# EAGLE design og1.1 (EAGLE 7.6.0)
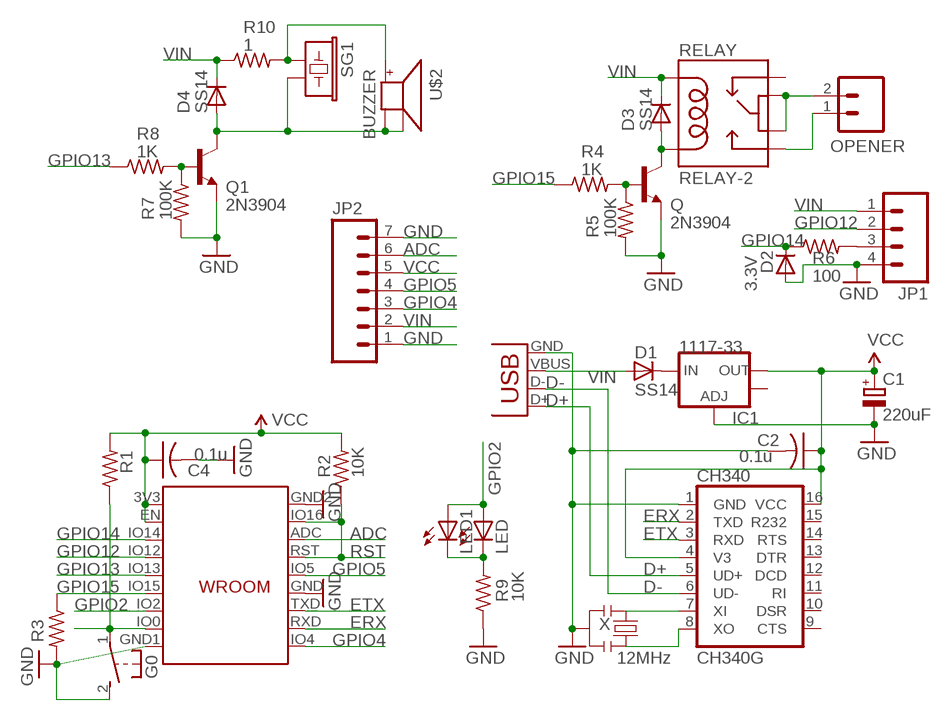
[diagram p0: schematic, sheet 1]

## Parts
C1  220uF  CPOL-EUCT3528  [CT3528]
C2  0.1u  C-USC0603K  [C0603K]
C4  0.1u  C-USC0603K  [C0603K]
CH340  CH340G  [SO16]
D1  SS14  DIODE-DO-214AC  [DO-214AC]
D2  3.3V  DIODE-MINIMELF  [MINIMELF]
D3  SS14  DIODE-DO-214AC  [DO-214AC]
D4  SS14  DIODE-DO-214AC  [DO-214AC]
ESP  WROOM02  [WROOM]
G0  31-XX  [B3F-31XX]
IC1  1117-33  V_REG_LM1117SOT223  [SOT223]
JP1  M04SONIC  [1X04_SONICSENSOR]
JP2  M07  [1X07]
LED  LEDLED3MM_ABBRV  [LED3MM_ABBRV]
LED1  LEDCHIPLED_0805  [CHIPLED_0805]
OPENER  OPENER  M024MM-X  [SCREWTERMINAL-4MM-2-X]
Q  2N3904  TRANSISTOR_NPNSOT23-3  [SOT23-3]
Q1  2N3904  TRANSISTOR_NPNSOT23-3  [SOT23-3]
R1  10K  R-US_R0603  [R0603]
R2  10K  R-US_R0603  [R0603]
R3  10K  R-US_R0603  [R0603]
R4  1K  R-US_R0603  [R0603]
R5  100K  R-US_R0603  [R0603]
R6  100  R-US_R0603  [R0603]
R7  100K  R-US_R0603  [R0603]
R8  1K  R-US_R0603  [R0603]
R9  10K  R-US_R0603  [R0603]
R10  1  R-US_R0603  [R0603]
RELAY  RELAY-2  [RELAY-HK4100F]
SG1  BUZZERPTH  [BUZZER-12MM]
U$2  BUZZER  [SMT-8585-BUZZER]
X  12MHz  RESONATORSMD  [RESONATOR-SMD]
X3  USB-MICROB  [USB-MICROB]

## Nets
ADC: ESP.ADC JP2.6
D+: CH340.5(UD+) X3.D+
D-: CH340.6(UD-) X3.D-
ERX: CH340.2(TXD) ESP.RXD(RX)
ETX: CH340.3(RXD) ESP.TXD(TX)
GND: C1.- C2.2 C4.2 CH340.1(GND) D2.A ESP.GND ESP.GND1 ESP.GND2 G0.2(S) IC1.1(ADJ) JP1.4 JP2.1 JP2.7 Q1.2(E) Q.2(E) R3.2 R5.2 R7.2 R9.1 X3.GND X.2
GPIO0: ESP.IO0 G0.1(P) R1.1
GPIO2: ESP.IO2 LED1.A LED.A
GPIO4: ESP.IO4 JP2.3
GPIO5: ESP.IO5 JP2.4
GPIO12: ESP.IO12 JP1.2
GPIO13: ESP.IO13 R8.1
GPIO14: D2.C ESP.IO14 R6.1
GPIO15: ESP.IO15 R3.1 R4.1
N$1: D1.C IC1.3(IN)
N$2: Q.1(B) R4.2 R5.1
N$3 [relaypower]: OPENER.2 RELAY.5 RELAY.6
N$4 [relaypower]: OPENER.1 RELAY.10
N$5: JP1.3 R6.2
N$6 [power]: D4.A Q1.3(C) SG1.- U$2.- U$2.A-
N$7: LED1.C LED.K(C) R9.2
N$8: Q1.1(B) R7.1 R8.2
N$9 [power]: R10.2 SG1.+ U$2.+
N$11: CH340.7(XI) X.1
N$13: CH340.8(XO) X.3
N$32 [power]: D3.A Q.3(C) RELAY.9
RST: ESP.IO16 ESP.RST R2.1
VCC [power]: C1.+ C2.1 C4.1 CH340.4(V3) CH340.16(VCC) ESP.3V3(VCC) ESP.EN IC1.2(OUT) JP2.5 R1.2 R2.2
VIN [power]: D1.A D3.C D4.C JP1.1 JP2.2 R10.1 RELAY.2 X3.VBUS
Unconnected: CH340.9(CTS) CH340.10(DSR) CH340.11(RI) CH340.12(DCD) CH340.13(DTR) CH340.14(RTS) CH340.15(R232) IC1.4(OUT) RELAY.1

## Library data of the parts
C1 = rcl:CPOL-EU: POLARIZED CAPACITOR, European symbol
C2 C4 = adafruit:C-US: CAPACITOR, American symbol
CH340 = SparkFunNew:CH340
D1-D4 = diode:DIODE-: DIODE
ESP = JeeParts:WROOM
G0 = adafruit:31-XX: OMRON SWITCH Now with beefier pads!
IC1 = SparkFun:V_REG_LM1117: Voltage Regulator LM1117 Standard adjustable voltage regulator but in SMD form. Spark Fun Electronics SKU : COM-00595
JP1 = SparkFun:M04: Header 4 Standard 4-pin 0.1" header. Use with straight break away headers (SKU : PRT-00116), right angle break away headers (PRT-00553), swiss pins (PRT-00743), machine pins (PRT-00117), and female headers (PRT-00115). Molex polarized connector foot print use with SKU : PRT-08231 with associated crimp pins and housings.
JP2 = SparkFun:M07: Header 7 Standard 7-pin 0.1" header. Use with straight break away headers (SKU : PRT-00116), right angle break away headers (PRT-00553), swiss pins (PRT-00743), machine pins (PRT-00117), and female headers (PRT-00115). NOTES ON THE VARIANTS LOCK and LOCK_LONGPADS... This footprint was designed to help hold the alignment of a through-hole component (i.e. 7-pin header) while soldering it into place. You may notice that each hole has been shifted either up or down by 0.005 of an inch from it's more standard position (which is usually a perfectly straight line). This slight alteration caused the pins (the squares in the middle) to touch the edges of the holes. Because they are alternating, it causes a "brace" to hold the header in place. 0.005 has proven to be the perfect amount of "off-center" position when using our standard breakaway headers. Although looks a little odd when you look at the bare footprint, once you have a header in there, the alteration is very hard to notice. Also, if you push a header all the way into place, it is covered up entirely on the bottom side. This idea of altering the position of holes to aid alignment will be further integrated into the Sparkfun Library for other footprints. It can help hold any component with 3 or more connection pins.
LED LED1 = adafruit:LED: LED OSRAM: - CHIPLED LG R971, LG N971, LY N971, LG Q971, LY Q971, LO R971, LY R971 LH N974, LH R974 LS Q976, LO Q976, LY Q976 LO Q996 - Hyper CHIPLED LW Q18S LB Q993, LB Q99A, LB R99A - SideLED LS A670, LO A670, LY A670, LG A670, LP A670 LB A673, LV A673, LT A673, LW A673 LH A674 LY A675 LS A676, LA A676, LO A676, LY A676, LW A676 LS A679, LY A679, LG A679 - Hyper Micro SIDELED® LS Y876, LA Y876, LO Y876, LY Y876 LT Y87S - SmartLED LW L88C, LW L88S LB L89C, LB L89S, LG L890 LS L89K, LO L89K, LY L89K LS L896, LA L896, LO L896, LY L896 - TOPLED LS T670, LO T670, LY T670, LG T670, LP T670 LSG T670, LSP T670, LSY T670, LOP T670, LYG T670 LG T671, LOG T671, LSG T671 LB T673, LV T673, LT T673, LW T673 LH T674 LS T676, LA T676, LO T676, LY T676, LB T676, LH T676, LSB T676, LW T676 LB T67C, LV T67C, LT T67C, LS T67K, LO T67K, LY T67K, LW E67C LS E67B, LA E67B, LO E67B, LY E67B, LB E67C, LV E67C, LT E67C LW T67C LS T679, LY T679, LG T679 LS T770, LO T770, LY T770, LG T770, LP T770 LB T773, LV T773, LT T773, LW T773 LH T774 LS E675, LA E675, LY E675, LS T675 LS T776, LA T776, LO T776, LY T776, LB T776 LHGB T686 LT T68C, LB T68C - Hyper Mini TOPLED® LB M676 - Mini TOPLED Santana® LG M470 LS M47K, LO M47K, LY M47K Source: http://www.osram.convergy.de/
OPENER = SparkFun:M02: Header 2 Standard 2-pin 0.1" header. Use with straight break away headers (SKU : PRT-00116), right angle break away headers (PRT-00553), swiss pins (PRT-00743), machine pins (PRT-00117), and female headers (PRT-00115). Molex polarized connector foot print use with SKU : PRT-08233 with associated crimp pins and housings.
Q Q1 = SparkFunNew:TRANSISTOR_NPN: Transistor NPN BJT configuration in SOT23 package. MMBT2222 is the common NPN we use. Double check BCE configuration again layout.
R1-R3 R9 = adafruit (picker 的冲突副本 2014-10-29):R-US_: RESISTOR, American symbol
R4-R8 R10 = adafruit2013:R-US_: RESISTOR, American symbol
RELAY = SparkFunNew:RELAY-2
SG1 = SparkFunNew:BUZZER: Buzzer 12mm Spark Fun Electronics SKU : Comp-Buzzer
U$2 = adafruit:BUZZER
X = SparkFunNew:RESONATOR: Resonator Small SMD resonator. This is the itty bitty 10/20MHz resonators with built in caps. CSTCE10M0G55 and CSTCE20M0V53. Footprint has been reviewed closely but hasn't been tested yet.
X3 = SparkFunNew:USB: USB Connectors USB-B-PTH is fully proven SKU : PRT-00139 USB-miniB is fully proven SKU : PRT-00587 USB-A-PCB is untested. USB-A-H is throughly reviewed, but untested. Spark Fun Electronics SKU : PRT-00437 USB-B-SMT is throughly reviewed, but untested. Needs silkscreen touching up. USB-A-S has not been used/tested USB-MB-H has not been used/tested

## Net classes
0 default: width 0.178 mm, clearance 0.178 mm
1 power: width 0.305 mm, clearance 0.203 mm
2 relaypower: width 0.508 mm, clearance 0.305 mm

## Board
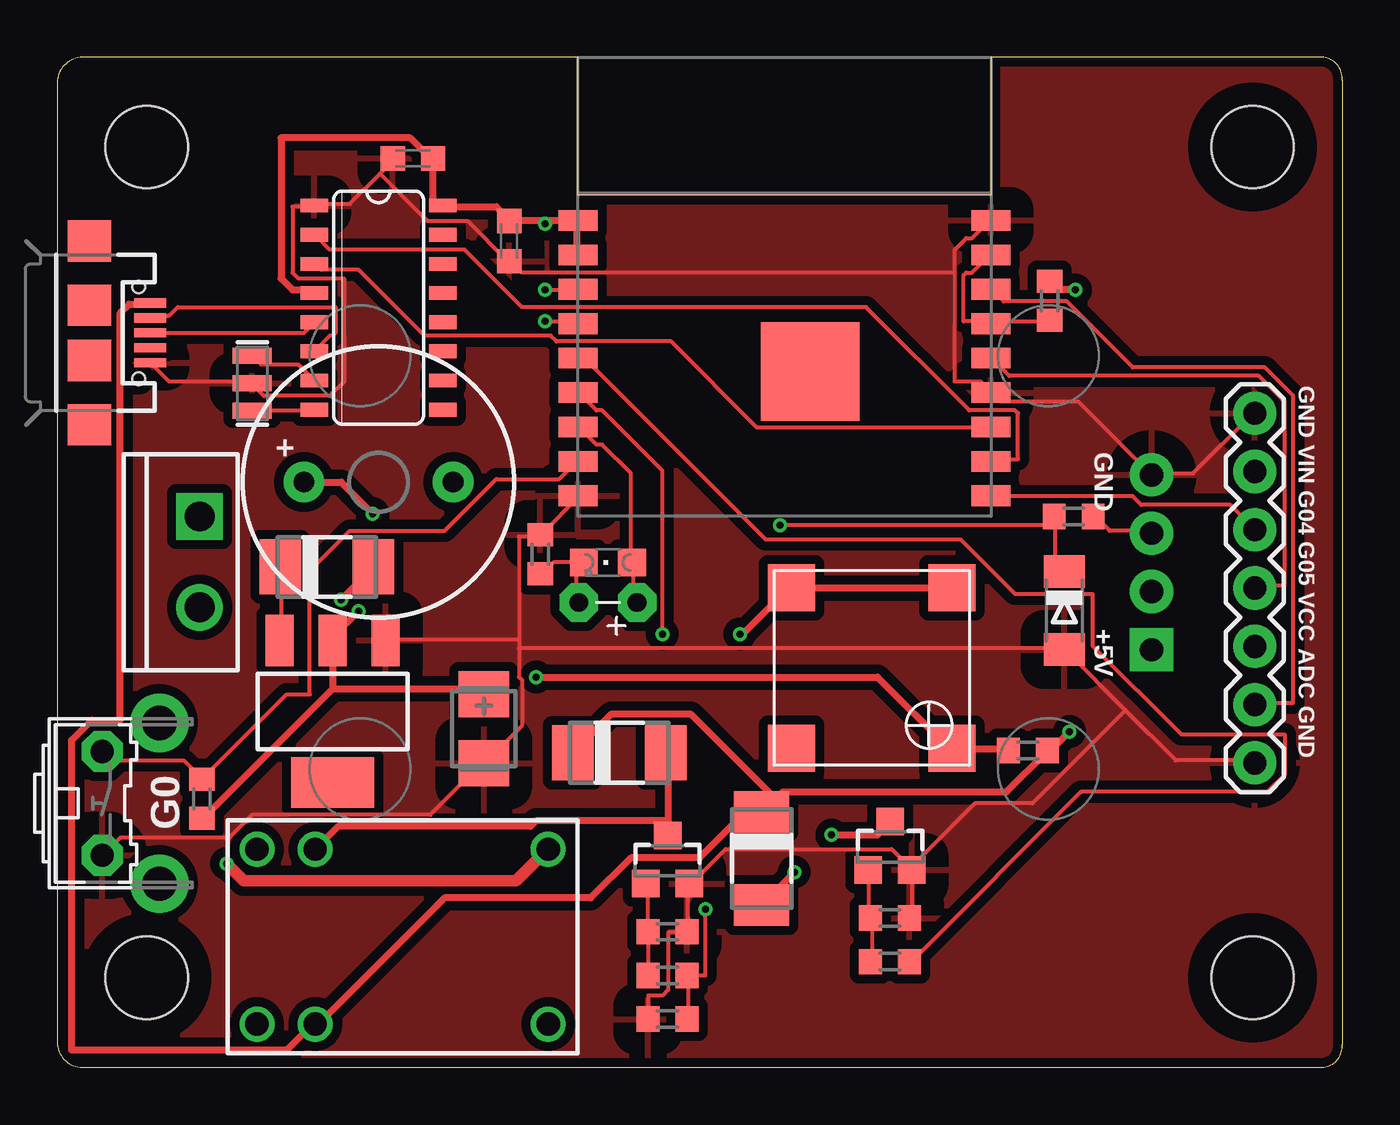
[diagram p1: board, top side]
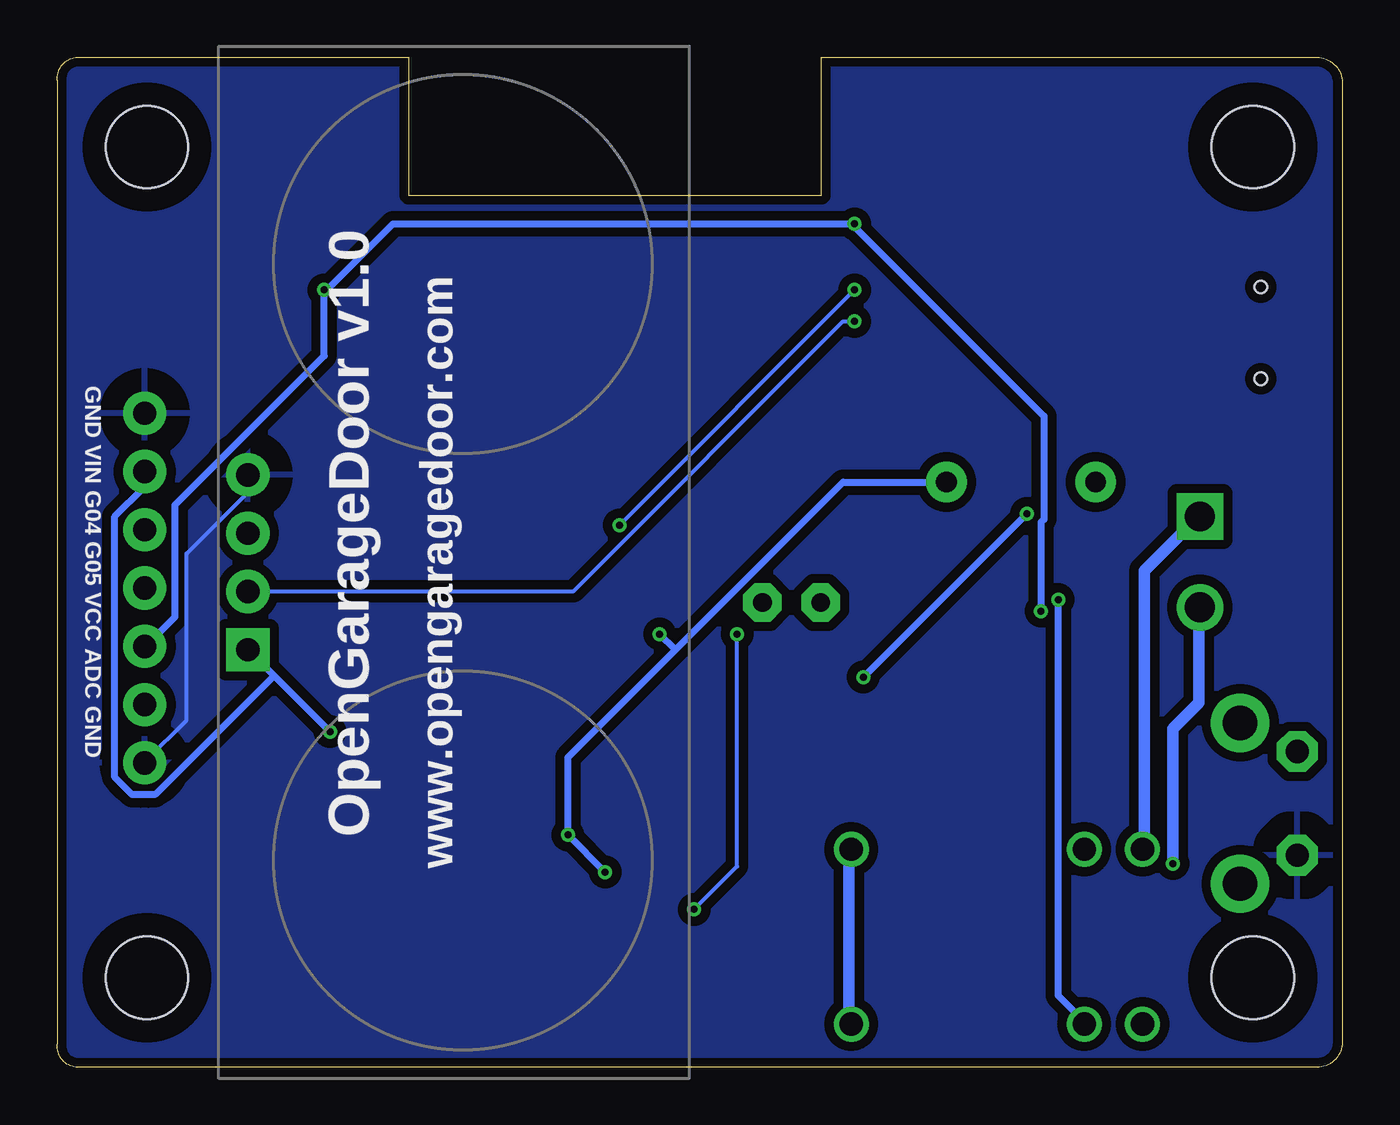
[diagram p2: board, bottom side, seen from below]

Size 56.01 x 44.01 mm. Coordinates in mm from the lower left corner, seen from the top.
Outline: 0,43 0,1 arc90 1.2,0 55.2,0 arc90 56,1 56,43 arc90 55.2,44 40.7,44 40.7,38 22.7,38 22.7,44 1.2,44 arc90 0,43
Copper layers (1*16): Top 0.035mm / dielectric 1.5mm / Bottom 0.035mm
Design rules "Fusion_eagle_rule_v1.1 *": minimum track width 6mil, minimum drill 12mil, track to track 6mil, track to pad 6mil, pad to pad 6mil, via to via 6mil, smd to smd 0mil, copper to edge 10mil, drill to drill 10mil, minimum pad ring 10mil, minimum via ring 6mil, stop-mask expansion 2mil, vias tented up to drill 100mil, thermal gap 40mil
Holes 3.6 mm at 3.9,3.9 52.1,3.9 3.9,40.1 52.1,40.1
tRestrict: area 1.5,37.7 to 6.3,42.5; area 1.5,1.5 to 6.3,6.3; area 49.7,37.7 to 54.5,42.5; area 49.7,1.5 to 54.5,6.3
bRestrict: area 1.5,37.7 to 6.3,42.5; area 1.5,1.5 to 6.3,6.3; area 49.7,1.5 to 54.5,6.3; area 49.7,37.7 to 54.5,42.5
vRestrict: area 22.8,24 to 40.6,38

### Footprints (pad centres in the part's own frame; a part is rotated, then mirrored left to right if it is on the bottom)
CT3528 = smd 2 x 2.2: + -1.5,0; - 1.5,0
C0603K = smd 1.05 x 1.08: 1 -0.875,0; 2 0.875,0
SO16 = smd 0.6 x 1.2: 1 -4.445,-2.8; 2 -3.175,-2.8; 3 -1.905,-2.8; 4 -0.635,-2.8; 5 0.635,-2.8; 6 1.905,-2.8; 7 3.175,-2.8; 8 4.445,-2.8; 9 4.445,2.8; 10 3.175,2.8; 11 1.905,2.8; 12 0.635,2.8; 13 -0.635,2.8; 14 -1.905,2.8; 15 -3.175,2.8; 16 -4.445,2.8
DO-214AC = smd 1.8 x 2.4: A 2.025,0; C -2.025,0
MINIMELF = smd 1.4 x 1.8: A 1.7,0; C -1.7,0
WROOM = smd 1.7 x 0.9: 3V3 -9,2.9; ADC 9,-0.1; EN -9,1.4; GND 9,-4.6; GND1 -9,-9.1; GND2 9,2.9; IO0 -9,-7.6; IO2 -9,-6.1; IO4 9,-9.1; IO5 9,-3.1; IO12 -9,-1.6; IO13 -9,-3.1; IO14 -9,-0.1; IO15 -9,-4.6; IO16 9,1.4; RST 9,-1.6; RXD 9,-7.6; TXD 9,-6.1 | smd 4.3 x 4.3: P$1 1.12,-3.68
B3F-31XX = drill 1.016 pad 1.778 octagon: 1 -2.261,-1.245; 2 2.261,-1.245 | drill 1.499 pad 2.54: 3 -3.505,1.245; 4 3.505,1.245
SOT223 = smd 1.219 x 2.235: 1 -2.311,-3.099; 2 0,-3.099; 3 2.311,-3.099 | smd 3.6 x 2.2: 4 0,3.099
1X04_SONICSENSOR = drill 1.016 pad 1.88 square: 1 -3.81,0 | drill 1.016 pad 1.88: 2 -1.27,0; 3 1.27,0; 4 3.81,0
1X07 = drill 1.016 pad 1.88: 1 0,0; 2 2.54,0; 3 5.08,0; 4 7.62,0; 5 10.16,0; 6 12.7,0; 7 15.24,0
LED3MM_ABBRV = drill 0.813 pad 1.676 octagon: A -1.27,0; K 1.27,0
CHIPLED_0805 = smd 1.2 x 1.2: A 0,-1.05; C 0,1.05
SCREWTERMINAL-4MM-2-X = drill 1.3 pad 2.032 square: 1 0,0 | drill 1.3 pad 2.032: 2 3.96,0
SOT23-3 = smd 1.2 x 1.2: 1 -0.95,-1; 2 0.95,-1; 3 0,1.1
R0603 = smd 1 x 1.1: 1 -0.85,0; 2 0.85,0
RELAY-HK4100F = drill 1.016: 1 12.7,7.62; 2 10.16,7.62; 5 0,7.62; 6 0,0; 9 10.16,0; 10 12.7,0
BUZZER-12MM = drill 0.9 pad 1.778: + 3.25,0; - -3.25,0
SMT-8585-BUZZER = smd 2.05 x 2.05: + -3.5,-3.5; - 3.5,-3.5; A- 3.5,3.5; NC1 -3.5,3.5
RESONATOR-SMD = smd 0.7 x 1.7: 1 -1.2,0; 2 0,0; 3 1.2,0
USB-MICROB = smd 0.4 x 1.4: D+ 0,2.65; D- -0.65,2.65; GND 1.3,2.65; ID 0.65,2.65; VBUS -1.3,2.65 | smd 1.8 x 1.9: MT1 -4,0; MT2 4,0; MT3 1.2,0; MT4 -1.2,0 | hole 0.55: -2,2.15; 2,2.15

### Placement (x,y rotation side)
C1  18.6,14.75 270 top
C2  15.5,39.6 180 top
C4  19.7,36 270 top
CH340  14,33.1 270 top
D1  11.75,21.8 0 top
D2  43.9,19.9 270 top
D3  24.5,13.7 0 top
D4  30.7,9.1 270 top
ESP  31.7,34 0 top
G0  3.2,11.5 270 top
IC1  12,15.5 180 top
JP1  47.7,22 90 top
JP2  52.2,28.5 270 top
LED  24,20.25 180 top
LED1  24,22 90 top
OPENER  6.2,24 270 top
Q  26.6,9 0 top
Q1  36.3,9.6 0 top
R1  6.3,11.7 270 top
R2  43.25,33.4 90 top
R3  26.6,2.1 180 top
R4  26.6,4 180 top
R5  26.6,5.9 0 top
R6  44.3,24 0 top
R7  36.3,6.5 0 top
R8  36.3,4.6 180 top
R9  21.05,22.35 270 top
R10  42.3,13.8 180 top
RELAY  21.4,9.5 180 top
SG1  14,25.5 180 top
U$2  35.5,17.4 90 top
X  8.5,29.8 270 top
X3  1.4,32 270 top

### Tracks (layer width: path | path; a pad name or v marks a point on that pad's centre or on a via)
ADC
  Top 0.178: ESP.ADC 40.75,33.88 41.25,33.38 44,33.38 46.88,30.5 52.62,30.5 53.88,29.25 53.88,15.88 52.25,15.88 JP2.6
D+
  Top 0.178: X3.D+ 10.75,32 11.12,32.38 CH340.5
D-
  Top 0.178: CH340.6 11.25,31.25 11.88,31.88 12,31.88 12.12,32 12.12,33.13 5.25,33.13 4.88,32.75 4.12,32.75 X3.D-
ERX
  Top 0.178: CH340.2 11.25,36.25 11.88,35.63 17.75,35.63 20.25,33.13 35.25,33.13 39.75,28.63 41.75,28.63 41.88,28.5 41.88,26.5 40.75,26.5 ESP.RXD
ETX
  Top 0.178: CH340.3 11.25,35 11.5,34.75 13.12,34.75 16,31.88 21.5,31.88 21.75,31.63 26.75,31.63 30.5,27.88 40.62,27.88 ESP.TXD
GND
  Top 0.178: X3.GND 4.88,29.88 8.5,29.88 X.2 8.5,29.75 9,29.25 11.88,29.25 12.5,29.88 12.5,34.38 10.5,34.38 10.25,34.63 10.25,37.5 11.12,37.5 CH340.1 11.25,37.63 12.75,37.63 14.06,38.94 | 14.06,38.94 14.62,39.5 C2.2 | 14.06,38.94 16.12,36.88 17.88,36.88 19.62,35.13 C4.2 19.75,35.13 20.25,34.63 39.12,34.63 | 39.12,34.63 39.12,29.88 40.25,29.88 40.62,29.5 ESP.GND 40.75,29.38 41.12,29 44.5,29 47.62,25.88 JP1.4 47.75,25.88 49.5,25.88 52.12,28.5 JP2.1 | 39.12,34.63 39.12,35.63 39.62,36.13 39.88,36.13 40.62,36.88 ESP.GND2 | ESP.GND1 22.75,24.88 21.12,23.25 R9.1 21,23.13 20.12,23.13 20.12,18.63 | 20.12,18.63 20.12,18.25 | 20.12,18.25 20.12,17 20.25,16.88 20.25,14.88 18.62,13.25 C1.- 18.5,13.25 16.25,11 8.5,11 7.5,10 2.75,10 2,9.25 G0.2 | 20.12,18.63 14.38,18.63 IC1.1 | Q1.2 37.25,6.5 R7.2 | R3.2 25.75,2.13 25.75,3.13 26.38,3.13 26.62,3.38 26.62,5.88 27.38,5.88 R5.2 27.5,6 27.5,8 Q.2 27.62,8 29.12,9.5 36.38,9.5 37.25,8.63 Q1.2 | 46.56,15.57 48.75,13.38 52.12,13.38 JP2.7 | 46.56,15.57 44,18.13 D2.A 43.88,18.25 20.12,18.25 | 46.56,15.57 42.5,11.5 40,11.5 37.25,8.75 Q1.2
  Bottom 0.178: JP1.4 47.75,25.75 47.75,25 50.38,22.38 50.38,15.13 52.12,13.38 JP2.7
  pour Top (isolate 0.406): 0,44 56,44 56,0 0,0
  pour Bottom (isolate 0.406): 0,44 56,44 56,0 0,0
GPIO0
  Top 0.178: G0.1 2,13.75 2.38,13.38 5.5,13.38 6.25,12.63 R1.1 10,16.25 11,16.25 11,21.63 12.75,23.38 16.88,23.38 19.12,25.63 21.88,25.63 22.62,26.38 ESP.IO0
GPIO2
  Top 0.178: LED.A 25.12,20.25 25.12,22 LED1.A 25,22 25,25.88 23.75,27.13 23.5,27.13 22.75,27.88 ESP.IO2
GPIO4
  Top 0.178: ESP.IO4 40.75,24.88 46.88,24.88 47.25,24.5 51.12,24.5 52.12,23.5 JP2.3
GPIO5
  Top 0.178: ESP.IO5 40.75,30.88 41.5,30.13 52.38,30.13 53.5,29 53.5,21 52.25,21 JP2.4
GPIO12  (via drill 0.3)
  Top 0.178: v21.25,32.5 22.62,32.5 ESP.IO12
  Bottom 0.178: v21.25,32.5 21.75,32.5 33.5,20.75 47.62,20.75 JP1.2
GPIO13
  Top 0.178: R8.1 37.25,4.63 44.62,12 52.75,12 53.5,12.75 53.5,14.5 49,14.5 45.12,18.38 45.12,20.63 41.75,20.63 39.38,23 30.88,23 23,30.88 22.75,30.88 ESP.IO13
GPIO14  (via drill 0.3)
  Top 0.178: 43.5,23.63 43.5,21.63 43.88,21.63 D2.C | 43.5,23.63 43.5,24 R6.1 43.5,23.63 | v21.25,33.88 22.62,33.88 ESP.IO14 | 43.5,23.63 v31.5,23.63
  Bottom 0.178: v31.5,23.63 v21.25,33.88
GPIO15  (via drill 0.3)
  Top 0.178: 27.5,4 27.5,2.13 R3.1 | v26.38,18.88 26.38,26 23.75,28.63 23.5,28.63 22.75,29.38 ESP.IO15 | v28.25,6.88 28.25,4 27.5,4 | 27.5,4 R4.1
  Bottom 0.178: v26.38,18.88 26.38,8.75 v28.25,6.88
N$1
  Top 0.178: IC1.3 9.75,18.63 9.75,21.75 D1.C
N$2
  Top 0.178: R4.2 R5.1 25.75,8 Q.1
N$3  (via drill 0.3)
  Top 0.508: v7.38,8.88 8.12,8.13 20,8.13 21.38,9.5 RELAY.6
  Bottom 0.508: RELAY.5 21.5,2 21.5,9.5 RELAY.6 | v7.38,8.88 7.38,14.75 6.25,15.88 6.25,20 OPENER.2
N$4
  Bottom 0.508: RELAY.10 8.62,9.5 8.62,21.63 6.25,24 OPENER.1
N$5
  Top 0.178: R6.2 45.25,24 45.88,23.38 47.62,23.38 JP1.3
N$6  (via drill 0.3)
  Top 0.305: U$2.- 39,20.88 32,20.88 U$2.A- 31.88,20.88 29.88,18.88 v29.75,18.88 | v33.75,10.13 35.75,10.13 36.25,10.63 Q1.3 | D4.A v32.12,8.5
  Bottom 0.305: v32.12,8.5 v33.75,10.13 33.75,13.5 29.06,18.19 | SG1.- 21.75,25.5 29.06,18.19 | 29.06,18.19 v29.75,18.88
N$7
  Top 0.178: LED1.C 22.62,22 | 22.62,22 21.62,22 21.12,21.5 R9.2 | 22.62,22 22.62,20.25 LED.K
N$8
  Top 0.178: R8.2 35.5,4.63 35.5,6.5 R7.1 35.38,6.5 35.38,8.5 Q1.1
N$9  (via drill 0.3)
  Top 0.305: R10.2 41.38,13.88 39,13.88 U$2.+ 38.88,13.88 35.75,17 v20.88,17 | v13.75,24.13 12.38,25.5 SG1.+
  Bottom 0.305: v13.75,24.13 v20.88,17
N$11
  Top 0.178: CH340.7 10.5,30.63 8.88,30.63 X.1
N$13
  Top 0.178: CH340.8 11.12,28.63 8.5,28.63 X.3
N$32
  Top 0.305: 26.62,10.75 26.62,13.63 D3.A | 26.62,10.75 26.62,10.13 Q.3 | 26.62,10.75 20.88,10.75 20.62,10.5 12.25,10.5 RELAY.9
RST
  Top 0.178: R2.1 43.25,32.5 40.75,32.5 ESP.RST 40.62,32.5 39.5,32.5 39.5,34.5 39.62,34.63 39.88,34.63 40.62,35.38 ESP.IO16
VCC  (via drill 0.3)
  Top 0.305: 12,16.5 6.38,10.88 R1.2 | 12,16.5 IC1.2 12,18.75 v13.12,19.88 | 12,16.5 18.25,16.5 18.5,16.25 C1.+ | 19.75,36.88 C4.1 | 21.25,36.88 22.62,36.88 ESP.3V3 22.62,36.75 22.62,35.5 ESP.EN | 21.25,36.88 C4.1 | CH340.4 11.12,33.75 11,33.88 10.25,33.88 9.75,34.38 9.75,40.5 15.38,40.5 16.25,39.63 C2.1 16.38,37.63 16.75,37.63 CH340.16 16.88,37.5 19.12,37.5 19.62,37 C4.1 | R2.2 43.62,33.88 v44.38,33.88 | v21.25,36.75 21.25,36.88
  Bottom 0.305: JP2.5 52.12,18.38 50.88,19.63 50.88,24.5 44.38,31 v44.38,33.88 44.25,33.88 41.38,36.75 v21.25,36.75 21.25,36.63 13,28.38 13,23.88 13.12,23.75 v13.12,19.88
VIN  (via drill 0.3)
  Top 0.305: X3.VBUS 4,33.25 3.12,33.25 2.75,32.88 2.75,15.13 1.5,15.13 0.62,14.25 0.62,0.75 10,0.75 11.12,1.88 RELAY.2 11.38,1.88 16.88,7.38 23.25,7.38 25,9.13 28,9.13 29.88,11 30.62,11 D4.C | v12.38,20.38 13.75,21.75 D1.A | D4.C 30.75,11.13 31.62,12 41.38,12 43.12,13.75 R10.1 43.25,13.88 43.38,13.88 v44.12,14.63 | D3.C 22.5,13.75 24.12,15.38 27.62,15.38 31.25,11.75 D4.C
  Bottom 0.305: v12.38,20.38 12.38,3.13 11.25,2 RELAY.2 | v44.12,14.63 46.56,17.07 | 46.56,17.07 47.62,18.13 JP1.1 | 46.56,17.07 51.75,11.88 52.75,11.88 53.5,12.63 53.5,24 52.25,25.25 52.25,25.88 JP2.2

### Text on the board
tNames: GND VIN G04 G05 VCC ADC GND | GND | + | +5V
bNames: OpenGarageDoor v1.0 | www.opengaragedoor.com | GND VIN G04 G05 VCC ADC GND